# EAGLE design tester (EAGLE 9.6.2)
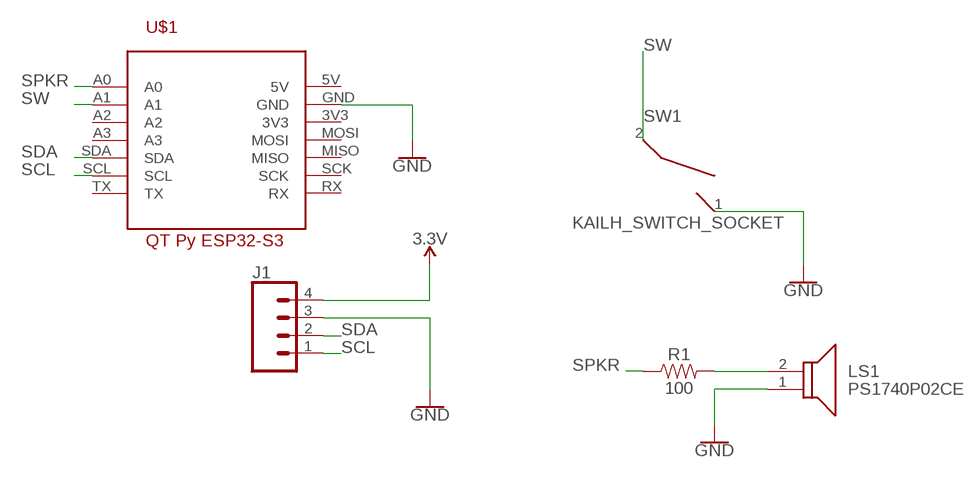
[diagram p0: schematic, sheet 1]

## Parts
J1  CONN_04  [1X04]
LS1  PS1740P02CE  [PS1740P02CE]
R1  100  100OHM-HORIZ-1/4W-1%  [AXIAL-0.3]
SW1  KAILH_SWITCH_SOCKET  [SWITCH_SOCKET]
U1  QTPY-ESP32-S3  [QTPY-ESP32-S3]

## Nets
3.3V: J1.4
GND: J1.3 LS1.1(GND) SW1.1 U1.GND
N$3: LS1.2(VCC) R1.P$2
SCL: J1.1 U1.SCL
SDA: J1.2 U1.SDA
SPKR: R1.P$1 U1.A0
SW: SW1.2 U1.A1
Unconnected: U1.3V3 U1.A2 U1.A3 U1.MISO U1.MOSI U1.RX U1.SCK U1.TX

## Power pins joined to a net without a drawn wire
5V: U1.5V

## Library data of the parts
J1 = SparkFun-Connectors:CONN_04: Multi connection point. Often used as Generic Header-pin footprint for 0.1 inch spaced/style header connections On any of the 0.1 inch spaced packages, you can populate with these: Break Away Headers - Straight <https://www.sparkfun.com/products/116> (PRT-00116) Break Away Male Headers - Right Angle <https://www.sparkfun.com/products/553> (PRT-00553) Female Headers <https://www.sparkfun.com/products/115> (PRT-00115) Break Away Headers - Machine Pin <https://www.sparkfun.com/products/117> (PRT-00117) Break Away Female Headers - Swiss Machine Pin <https://www.sparkfun.com/products/743> (PRT-00743) For SCREWTERMINALS and SPRING TERMINALS visit here: Screw Terimnals on SparkFun.com <https://www.sparkfun.com/search/results?term=Screw+Terminals> (5mm/3.5mm/2.54mm spacing) This device is also useful as a general connection point to wire up your design to another part of your project. Our various solder wires solder well into these plated through hole pads. Hook-Up Wire - Assortment (Stranded, 22 AWG) <https://www.sparkfun.com/products/11375> (PRT-11375) Hook-Up Wire - Assortment (Solid Core, 22 AWG) <https://www.sparkfun.com/products/11367> (PRT-11367) View the entire wire category on our website here <https://www.sparkfun.com/categories/141> Special notes: Molex polarized connector foot print use with SKU : PRT-08231 with associated crimp pins and housings. 1MM SMD Version SKU: PRT-10208; PROD_ID: CONN-09696
LS1 = SamacSys_Parts:PS1740P02CE: TDK 3 30 V dc PCB Mount High External Piezo Buzzer, Maximum of 4 kHz Source: Datasheet <https://product.tdk.com/system/files/dam/doc/product/sw_piezo/sw_piezo/piezo-buzzer/catalog/piezoelectronic_buzzer_ps_en.pdf>; DESCRIPTION: TDK 3 30 V dc PCB Mount High External Piezo Buzzer, Maximum of 4 kHz; HEIGHT: 4.9mm; MANUFACTURER_NAME: TDK; MANUFACTURER_PART_NUMBER: PS1740P02CE; MOUSER_PART_NUMBER: 810-PS1740P02CE; MOUSER_PRICE-STOCK: https://www.mouser.co.uk/ProductDetail/TDK/PS1740P02CE?qs=80T3JVN997ANK5awI1HgwA%3D%3D
R1 = SparkFun-Resistors:100OHM: 100Ω resistor A resistor is a passive two-terminal electrical component that implements electrical resistance as a circuit element. Resistors act to reduce current flow, and, at the same time, act to lower voltage levels within circuits. - Wikipedia; PROD_ID: RES-12181
SW1 = Kailh_switch_socket:KAILH_SWITCH_SOCKET
U1 = QtPy:QTPY-ESP32-S3

## Board
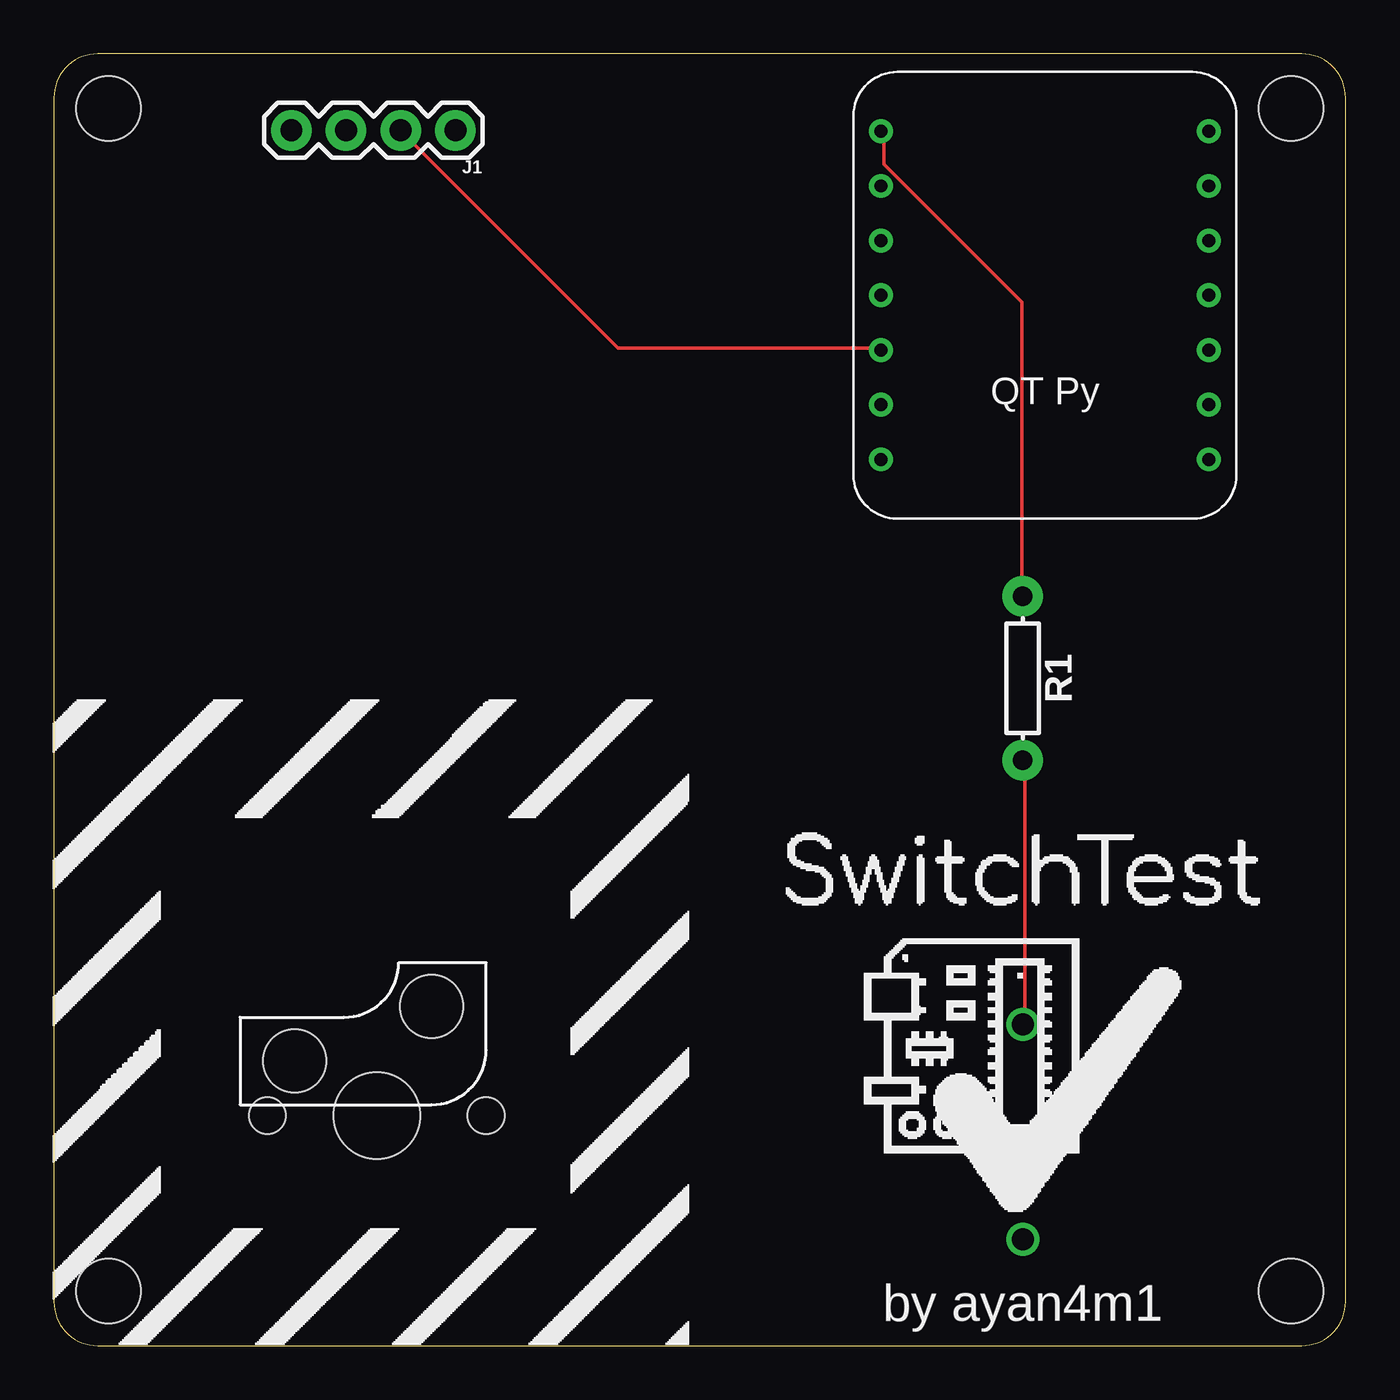
[diagram p1: board, top side]
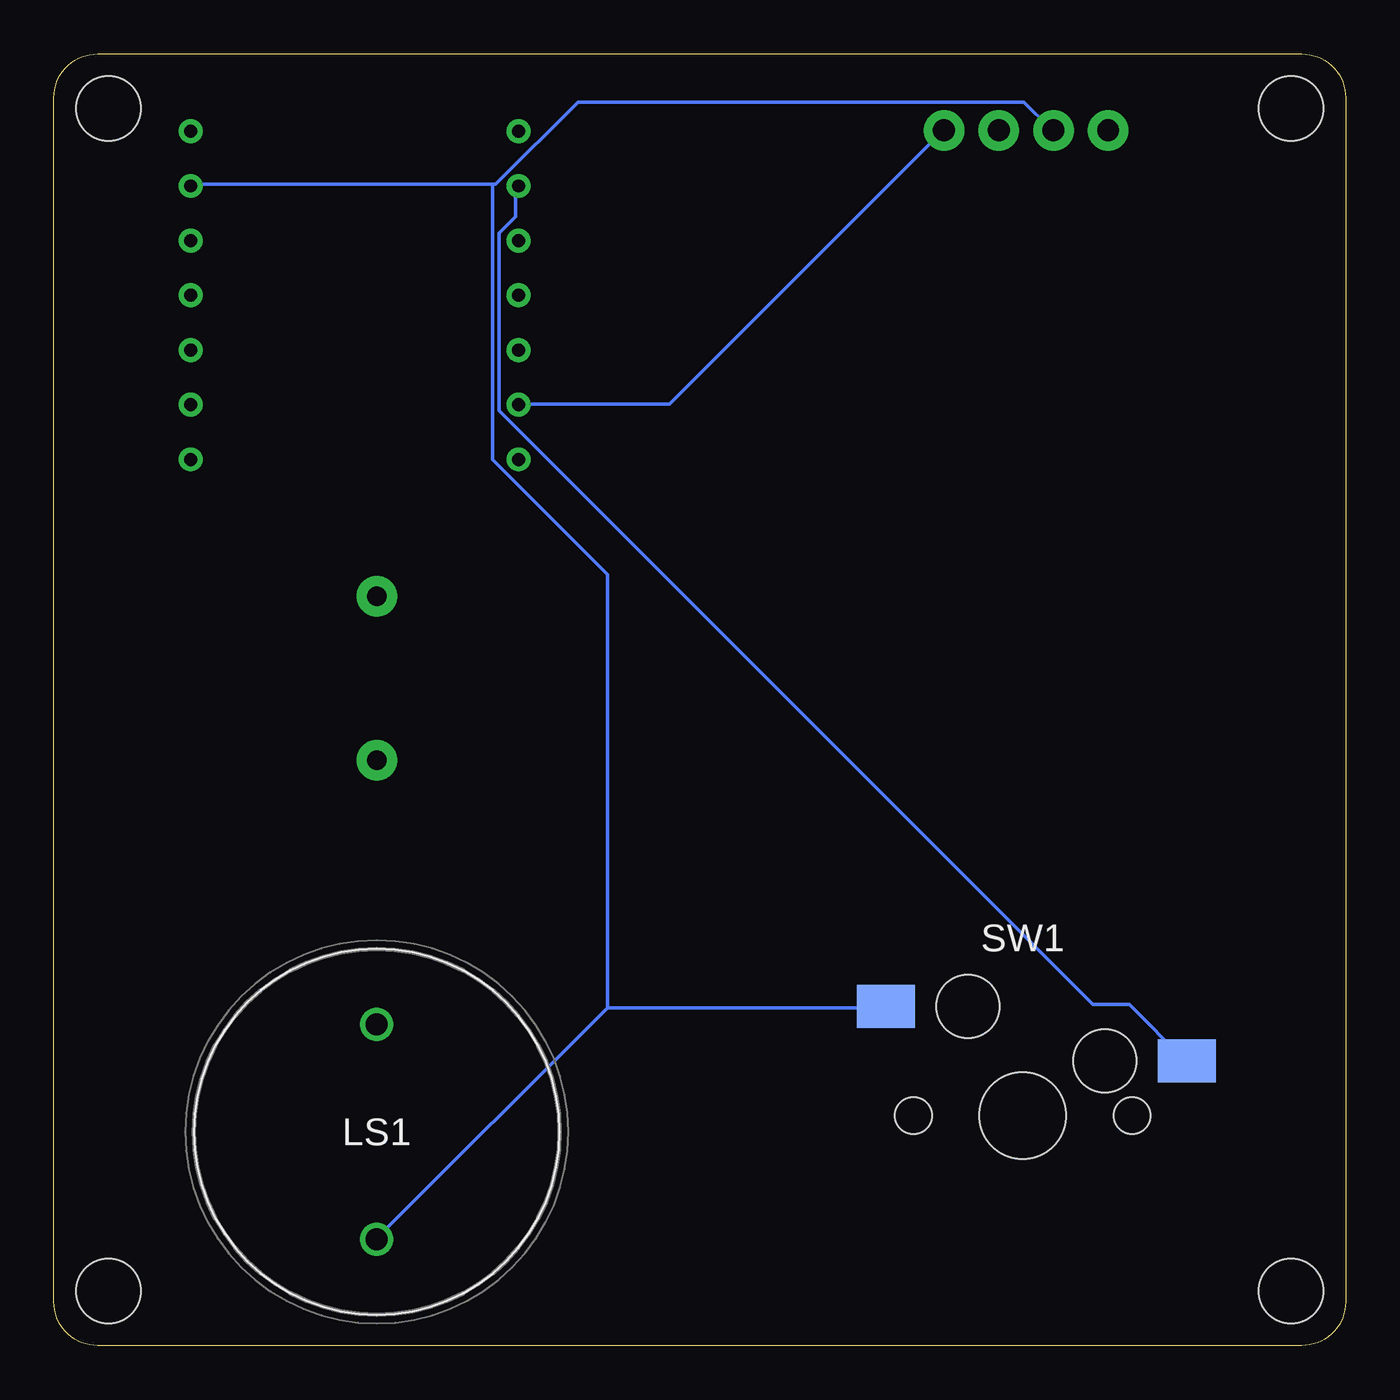
[diagram p2: board, bottom side, seen from below]

Size 60 x 60 mm. Coordinates in mm from the lower left corner, seen from the top.
Outline: 0,57.97 0,2.03 arc90 2.03,0 57.97,0 arc90 60,2.03 60,57.97 arc90 57.97,60 2.03,60 arc90 0,57.97
Copper layers (1*16): Top 0.035mm / dielectric 1.5mm / Bottom 0.035mm
Design rules "default": minimum track width 6mil, minimum drill 0.35mm, track to track 6mil, track to pad 6mil, pad to pad 6mil, via to via 6mil, smd to smd 6mil, copper to edge 40mil, drill to drill 6mil, minimum pad ring 10mil, minimum via ring 8mil, stop-mask expansion 4mil, vias tented up to drill 0mil, thermal gap 10mil
Holes 3 mm at 2.54,2.54 57.46,2.54 2.54,57.46 57.46,57.46

### Footprints (pad centres in the part's own frame; a part is rotated, then mirrored left to right if it is on the bottom)
1X04 = drill 1.016 pad 1.88: 1 0,0; 2 2.54,0; 3 5.08,0; 4 7.62,0
PS1740P02CE = drill 1.02 pad 1.53: 1 0,0; 2 0,10
AXIAL-0.3 = drill 0.9 pad 1.88: P$1 -3.81,0; P$2 3.81,0
SWITCH_SOCKET = smd 2.7 x 2 bottom: 1 6.355,5.08; 2 -7.625,2.54 | hole 4: 0,0 | hole 2.93: -3.81,2.54; 2.54,5.08 | hole 1.7: -5.08,0; 5.08,0
QTPY-ESP32-S3 = drill 0.6: 3V3 7.62,2.54; 5V 7.62,7.62; A0 -7.62,7.62; A1 -7.62,5.08; A2 -7.62,2.54; A3 -7.62,0; GND 7.62,5.08; MISO 7.62,-2.54; MOSI 7.62,0; RX 7.62,-7.62; SCK 7.62,-5.08; SCL -7.62,-5.08; SDA -7.62,-2.54; TX -7.62,-7.62

### Placement (x,y rotation side)
J1  18.65,56.45 180 top
LS1  45,4.93 0 bottom
R1  45,31 270 top
SW1  15,10.68 0 top
U1  46.03,48.78 0 top

### Tracks (layer width: path | path; a pad name or v marks a point on that pad's centre or on a via)
GND
  Bottom 0.152: 34.29,15.7 21.49,15.7 SW1.1 | 34.29,15.7 44.96,5.03 LS1.1 | 39.62,53.95 39.47,53.95 35.66,57.76 14.94,57.76 13.72,56.54 J1.3 | 39.62,53.95 53.65,53.95 U1.GND | 34.29,15.7 34.29,35.81 39.62,41.15 39.62,53.95
N$3
  Top 0.152: LS1.2 45.11,14.94 45.11,27.13 R1.P$2
SCL
  Bottom 0.152: U1.SCL 38.41,43.74 31.39,43.74 18.75,56.39 J1.1
SDA
  Top 0.152: U1.SDA 38.41,46.33 26.21,46.33 16.15,56.39 J1.2
SPKR
  Top 0.152: U1.A0 38.56,56.39 38.56,54.86 44.96,48.46 44.96,34.9 R1.P$1
SW
  Bottom 0.152: U1.A1 38.56,53.8 38.56,52.43 39.32,51.66 39.32,43.43 11.73,15.85 10.06,15.85 7.47,13.26 SW1.2

### Text on the board
tNames: by ayan4m1